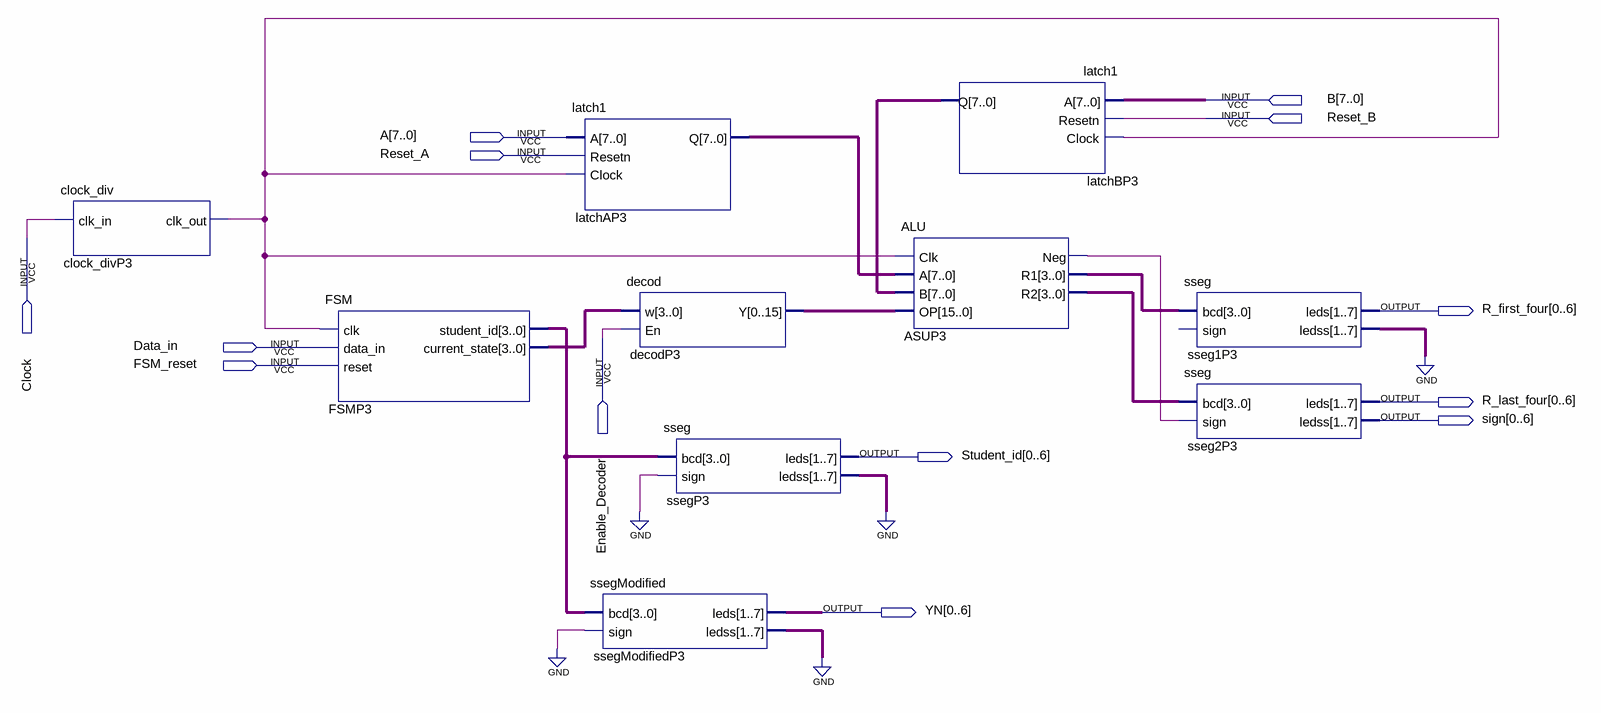
[diagram p0: schematic sheet]
// Quartus schematic Problem3Block.bdf as structural Verilog: 10 symbols, 13 pins
module Problem3Block (
  input  [7:0] B,
  input  Reset_B,
  input  [7:0] A,
  input  Reset_A,
  input  Clock,
  input  Enable_Decoder,
  input  Data_in,
  input  FSM_reset,
  output [0:6] R_first_four,
  output [0:6] R_last_four,
  output [0:6] sign,
  output [0:6] Student_id,
  output [0:6] YN
);

  wire ASUP3_neg, clock_divP3_clk_out;
  wire [3:0] ASUP3_r1, ASUP3_r2, FSMP3_current_state, FSMP3_student_id;
  wire [6:0] sseg1P3_ledss, ssegModifiedP3_ledss, ssegP3_ledss;
  wire [7:0] latchAP3_q, latchBP3_q;
  wire [15:0] decodP3_y;

  clock_div clock_divP3 (.clk_in(Clock), .clk_out(clock_divP3_clk_out));
  FSM FSMP3 (
    .clk(clock_divP3_clk_out), .data_in(Data_in), .reset(FSM_reset), .student_id(FSMP3_student_id),
    .current_state(FSMP3_current_state));
  latch1 latchAP3 (.A(A), .Resetn(Reset_A), .Clock(clock_divP3_clk_out), .Q(latchAP3_q));
  ssegModified ssegModifiedP3 (.bcd(FSMP3_student_id), .sign(1'b0), .leds(YN), .ledss(ssegModifiedP3_ledss));
  decod decodP3 (.w(FSMP3_current_state), .En(Enable_Decoder), .Y(decodP3_y));
  sseg ssegP3 (.bcd(FSMP3_student_id), .sign(1'b0), .leds(Student_id), .ledss(ssegP3_ledss));
  ALU ASUP3 (
    .Clk(clock_divP3_clk_out), .A(latchAP3_q), .B(latchBP3_q), .OP(decodP3_y), .Neg(ASUP3_neg),
    .R1(ASUP3_r1), .R2(ASUP3_r2));
  latch1 latchBP3 (.A(B), .Resetn(Reset_B), .Clock(clock_divP3_clk_out), .Q(latchBP3_q));
  sseg sseg1P3 (.bcd(ASUP3_r1), .leds(R_first_four), .ledss(sseg1P3_ledss));  // open: sign
  sseg sseg2P3 (.bcd(ASUP3_r2), .sign(ASUP3_neg), .leds(R_last_four), .ledss(sign));
  // also tied to GND on the sheet: {ssegModifiedP3_ledss[0], ssegModifiedP3_ledss[1], ssegModifiedP3_ledss[2], ssegModifiedP3_ledss[3], ssegModifiedP3_ledss[4], ssegModifiedP3_ledss[5], ssegModifiedP3_ledss[6], sseg1P3_ledss[0], sseg1P3_ledss[1], sseg1P3_ledss[2], sseg1P3_ledss[3], sseg1P3_ledss[4], sseg1P3_ledss[5], sseg1P3_ledss[6], ssegP3_ledss[0], ssegP3_ledss[1], ssegP3_ledss[2], ssegP3_ledss[3], ssegP3_ledss[4], ssegP3_ledss[5], ssegP3_ledss[6]}
endmodule
